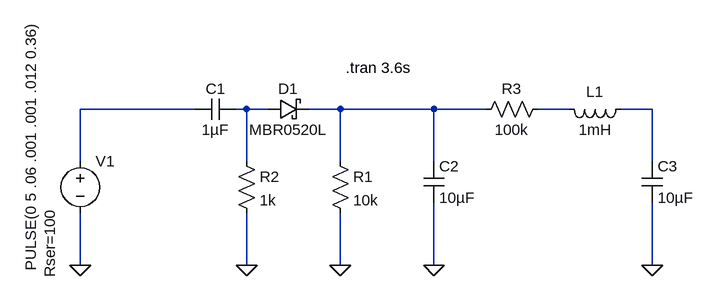
[diagram p0: schematic RPM_DC_filter.asc]
RPM_DC_filter.asc, the LTspice schematic file:
Version 4
SHEET 1 880 680
WIRE 64 64 -112 64
WIRE 144 64 128 64
WIRE 176 64 144 64
WIRE 288 64 240 64
WIRE 432 64 288 64
WIRE 512 64 432 64
WIRE 640 64 592 64
WIRE 768 64 720 64
WIRE -112 144 -112 64
WIRE 144 144 144 64
WIRE 288 144 288 64
WIRE 432 144 432 64
WIRE 768 144 768 64
WIRE -112 304 -112 224
WIRE 144 304 144 224
WIRE 288 304 288 224
WIRE 432 304 432 208
WIRE 768 304 768 208
FLAG -112 304 0
FLAG 288 304 0
FLAG 432 304 0
FLAG 144 304 0
FLAG 768 304 0
SYMBOL voltage -112 128 R0
WINDOW 3 -76 -200 VRight 2
WINDOW 123 0 0 Left 0
WINDOW 39 -47 89 VRight 2
SYMATTR InstName V1
SYMATTR Value PULSE(0 5 .06 .001 .001 .012 0.36)
SYMATTR SpiceLine Rser=100
SYMBOL cap 128 48 R90
WINDOW 0 0 32 VBottom 2
WINDOW 3 32 32 VTop 2
SYMATTR InstName C1
SYMATTR Value 1µF
SYMBOL res 272 128 R0
SYMATTR InstName R1
SYMATTR Value 10k
SYMBOL cap 416 144 R0
SYMATTR InstName C2
SYMATTR Value 10µF
SYMBOL schottky 176 80 R270
WINDOW 0 32 32 VTop 2
WINDOW 3 0 32 VBottom 2
SYMATTR InstName D1
SYMATTR Value MBR0520L
SYMATTR Description Diode
SYMATTR Type diode
SYMBOL res 128 128 R0
SYMATTR InstName R2
SYMATTR Value 1k
SYMBOL cap 752 144 R0
SYMATTR InstName C3
SYMATTR Value 10µF
SYMBOL ind 736 48 R90
WINDOW 0 5 56 VBottom 2
WINDOW 3 32 56 VTop 2
SYMATTR InstName L1
SYMATTR Value 1mH
SYMBOL res 608 48 R90
WINDOW 0 0 56 VBottom 2
WINDOW 3 32 56 VTop 2
SYMATTR InstName R3
SYMATTR Value 100k
TEXT 296 0 Left 2 !.tran 3.6s

The netlist it stands for:
* RPM_DC_filter.asc
V1 N001 0 PULSE(0 5 .06 .001 .001 .012 0.36) Rser=100
C1 N002 N001 1µF
R1 N003 0 10k
C2 N003 0 10µF
D1 N002 N003 MBR0520L
R2 N002 0 1k
C3 N005 0 10µF
L1 N005 N004 1mH
R3 N004 N003 100k
.model D D
.lib standard.dio
.tran 3.6s
.backanno
.end